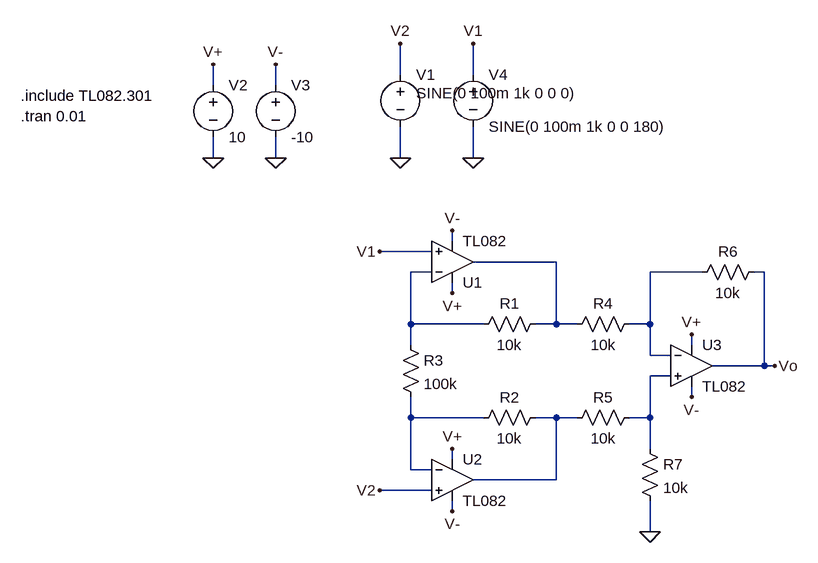
[diagram p0: schematic instrumentation-amplifiers.asc]
instrumentation-amplifiers.asc, the LTspice schematic file:
Version 4
SHEET 1 1132 680
WIRE 112 -528 112 -576
WIRE 224 -528 224 -576
WIRE -176 -512 -176 -544
WIRE -80 -512 -80 -544
WIRE -176 -400 -176 -432
WIRE -80 -400 -80 -432
WIRE 112 -400 112 -448
WIRE 224 -400 224 -448
WIRE 192 -272 192 -288
WIRE 160 -256 80 -256
WIRE 352 -240 224 -240
WIRE 160 -224 128 -224
WIRE 576 -224 496 -224
WIRE 672 -224 656 -224
WIRE 192 -192 192 -208
WIRE 128 -144 128 -224
WIRE 240 -144 128 -144
WIRE 352 -144 352 -240
WIRE 352 -144 320 -144
WIRE 384 -144 352 -144
WIRE 496 -144 496 -224
WIRE 496 -144 464 -144
WIRE 128 -112 128 -144
WIRE 560 -112 560 -128
WIRE 496 -96 496 -144
WIRE 528 -96 496 -96
WIRE 672 -80 672 -224
WIRE 672 -80 592 -80
WIRE 688 -80 672 -80
WIRE 528 -64 496 -64
WIRE 560 -32 560 -48
WIRE 128 0 128 -32
WIRE 240 0 128 0
WIRE 352 0 320 0
WIRE 384 0 352 0
WIRE 496 0 496 -64
WIRE 496 0 464 0
WIRE 496 48 496 0
WIRE 192 64 192 48
WIRE 128 80 128 0
WIRE 160 80 128 80
WIRE 352 96 352 0
WIRE 352 96 224 96
WIRE 160 112 80 112
WIRE 192 144 192 128
WIRE 496 176 496 128
FLAG -176 -544 V+
FLAG -80 -544 V-
FLAG -176 -400 0
FLAG -80 -400 0
FLAG 192 -192 V+
FLAG 192 -288 V-
FLAG 192 48 V+
FLAG 192 144 V-
FLAG 560 -128 V+
FLAG 560 -32 V-
FLAG 80 112 V2
FLAG 80 -256 V1
FLAG 688 -80 Vo
FLAG 496 176 0
FLAG 224 -576 V1
FLAG 112 -576 V2
FLAG 112 -400 0
FLAG 224 -400 0
SYMBOL OpAmps\\opamp2 192 -176 M180
SYMATTR InstName U1
SYMATTR Value TL082
SYMBOL voltage -176 -528 R0
WINDOW 123 0 0 Left 0
WINDOW 39 0 0 Left 0
SYMATTR InstName V2
SYMATTR Value 10
SYMBOL voltage -80 -528 R0
WINDOW 123 0 0 Left 0
WINDOW 39 0 0 Left 0
SYMATTR InstName V3
SYMATTR Value -10
SYMBOL OpAmps\\opamp2 192 32 R0
SYMATTR InstName U2
SYMATTR Value TL082
SYMBOL OpAmps\\opamp2 560 -144 R0
SYMATTR InstName U3
SYMATTR Value TL082
SYMBOL res 336 -160 R90
WINDOW 0 0 56 VBottom 2
WINDOW 3 32 56 VTop 2
SYMATTR InstName R1
SYMATTR Value 10k
SYMBOL res 336 -16 R90
WINDOW 0 0 56 VBottom 2
WINDOW 3 32 56 VTop 2
SYMATTR InstName R2
SYMATTR Value 10k
SYMBOL res 112 -128 R0
SYMATTR InstName R3
SYMATTR Value 100k
SYMBOL res 480 -160 R90
WINDOW 0 0 56 VBottom 2
WINDOW 3 32 56 VTop 2
SYMATTR InstName R4
SYMATTR Value 10k
SYMBOL res 480 -16 R90
WINDOW 0 0 56 VBottom 2
WINDOW 3 32 56 VTop 2
SYMATTR InstName R5
SYMATTR Value 10k
SYMBOL res 672 -240 R90
WINDOW 0 0 56 VBottom 2
WINDOW 3 32 56 VTop 2
SYMATTR InstName R6
SYMATTR Value 10k
SYMBOL res 480 32 R0
SYMATTR InstName R7
SYMATTR Value 10k
SYMBOL voltage 112 -544 R0
WINDOW 3 24 44 Left 2
WINDOW 123 24 44 Left 2
WINDOW 39 0 0 Left 0
SYMATTR Value SINE(0 100m 1k 0 0 0)
SYMATTR InstName V1
SYMBOL voltage 224 -544 R0
WINDOW 123 0 0 Left 0
WINDOW 39 0 0 Left 0
SYMATTR InstName V4
SYMATTR Value SINE(0 100m 1k 0 0 180)
TEXT -472 -496 Left 2 !.include TL082.301
TEXT -472 -464 Left 2 !.tran 0.01

The netlist it stands for:
* instrumentation-amplifiers.asc
XU1 V1 N002 V+ V- N001 TL082  ; pins In+ In- V+ V- OUT
V2 V+ 0 10
V3 V- 0 -10
XU2 V2 N005 V+ V- N006 TL082  ; pins In+ In- V+ V- OUT
XU3 N004 N003 V+ V- Vo TL082  ; pins In+ In- V+ V- OUT
R1 N001 N002 10k
R2 N006 N005 10k
R3 N002 N005 100k
R4 N003 N001 10k
R5 N004 N006 10k
R6 Vo N003 10k
R7 N004 0 10k
V1 V2 0 SINE(0 100m 1k 0 0 0)
V4 V1 0 SINE(0 100m 1k 0 0 180)
.include TL082.301
.tran 0.01
.backanno
.end